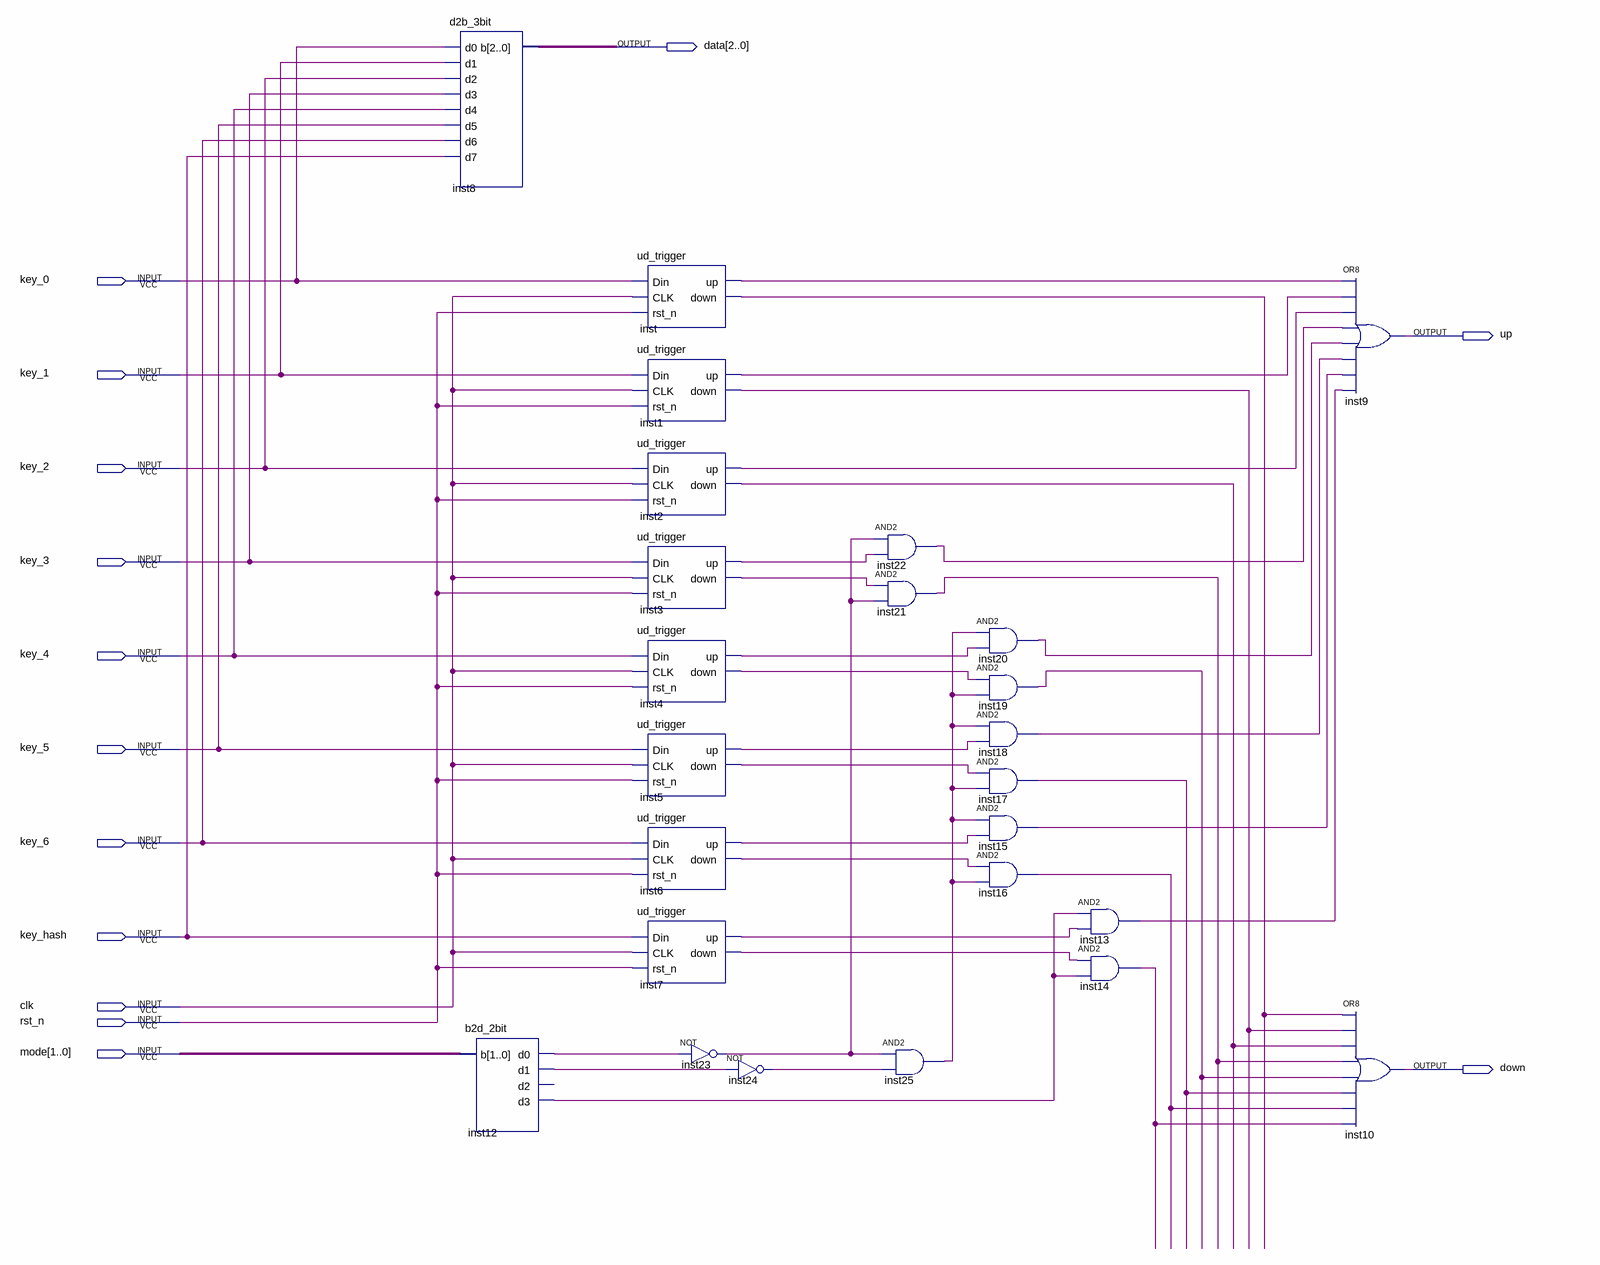
[diagram p0: schematic sheet]
// Quartus schematic keypad.bdf as structural Verilog: 25 symbols, 14 pins
module keypad (
  input  key_0,
  input  key_1,
  input  key_2,
  input  key_3,
  input  key_4,
  input  key_5,
  input  key_6,
  input  key_hash,
  input  clk,
  input  rst_n,
  input  [1:0] mode,
  output [2:0] data,
  output up,
  output down
);

  wire inst1_down, inst1_up, inst2_down, inst2_up, inst3_down, inst3_up, inst4_down, inst4_up, inst5_down,
       inst5_up, inst6_down, inst6_up, inst7_down, inst7_up, inst12_d0, inst12_d1, inst12_d3, inst13_out,
       inst14_out, inst15_out, inst16_out, inst17_out, inst18_out, inst19_out, inst20_out, inst21_out,
       inst22_out, inst23_out, inst24_out, inst25_out, inst_down, inst_up;

  d2b_3bit inst8 (
    .d0(key_0), .d1(key_1), .d2(key_2), .d3(key_3), .d4(key_4), .d5(key_5), .d6(key_6), .d7(key_hash),
    .b(data));
  b2d_2bit inst12 (.b(mode), .d0(inst12_d0), .d1(inst12_d1), .d3(inst12_d3));  // open: d2
  ud_trigger inst (.Din(key_0), .CLK(clk), .rst_n(rst_n), .up(inst_up), .down(inst_down));
  ud_trigger inst1 (.Din(key_1), .CLK(clk), .rst_n(rst_n), .up(inst1_up), .down(inst1_down));
  ud_trigger inst2 (.Din(key_2), .CLK(clk), .rst_n(rst_n), .up(inst2_up), .down(inst2_down));
  ud_trigger inst3 (.Din(key_3), .CLK(clk), .rst_n(rst_n), .up(inst3_up), .down(inst3_down));
  ud_trigger inst4 (.Din(key_4), .CLK(clk), .rst_n(rst_n), .up(inst4_up), .down(inst4_down));
  ud_trigger inst5 (.Din(key_5), .CLK(clk), .rst_n(rst_n), .up(inst5_up), .down(inst5_down));
  ud_trigger inst6 (.Din(key_6), .CLK(clk), .rst_n(rst_n), .up(inst6_up), .down(inst6_down));
  ud_trigger inst7 (.Din(key_hash), .CLK(clk), .rst_n(rst_n), .up(inst7_up), .down(inst7_down));
  not inst23 (inst23_out, inst12_d0);
  not inst24 (inst24_out, inst12_d1);
  and inst22 (inst22_out, inst23_out, inst3_up);
  and inst21 (inst21_out, inst3_down, inst23_out);
  and inst25 (inst25_out, inst23_out, inst24_out);
  and inst20 (inst20_out, inst25_out, inst4_up);
  and inst19 (inst19_out, inst4_down, inst25_out);
  and inst18 (inst18_out, inst25_out, inst5_up);
  and inst17 (inst17_out, inst5_down, inst25_out);
  and inst15 (inst15_out, inst25_out, inst6_up);
  and inst16 (inst16_out, inst6_down, inst25_out);
  and inst13 (inst13_out, inst12_d3, inst7_up);
  and inst14 (inst14_out, inst7_down, inst12_d3);
  or inst9 (up, inst_up, inst1_up, inst2_up, inst22_out, inst20_out, inst18_out, inst15_out, inst13_out);
  or inst10 (down, inst_down, inst1_down, inst2_down, inst21_out, inst19_out, inst17_out, inst16_out, inst14_out);
endmodule
